# Altium schematic sheet dcdc5v.SchDoc
size A3; Organization: Yandex; Address2: 11 Timura Frunze st., building 2; Release_Date: yyyy-mm-dd; Language: en; Organization2: Self Driving Group LLC
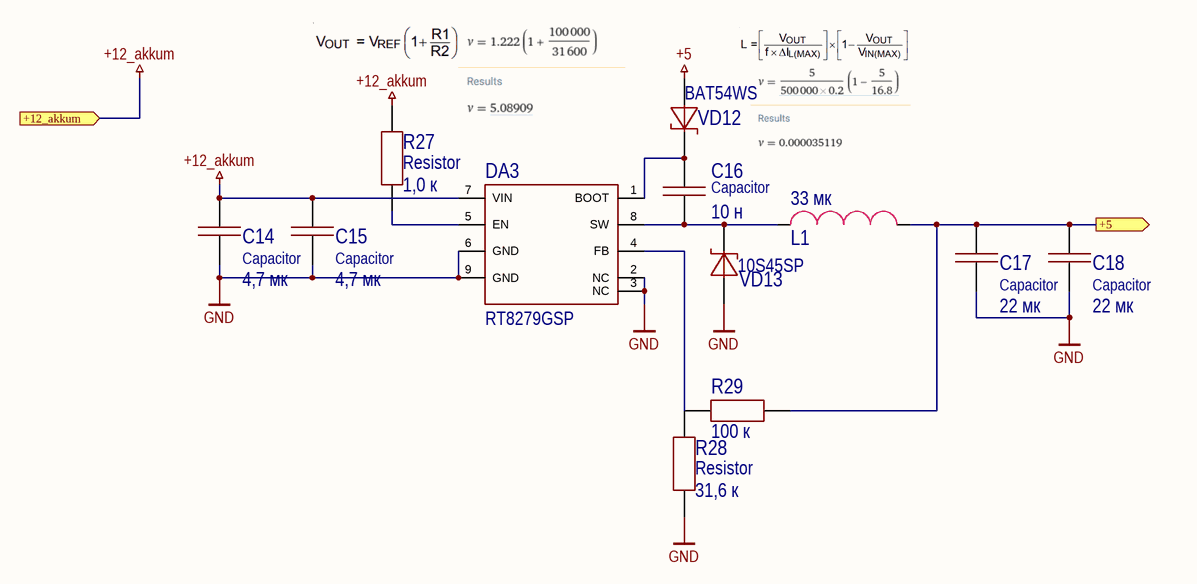
[diagram p0: dcdc5v.SchDoc]

## Parts
C14  Capacitor  value 4,7 мк  [1206C]
C15  Capacitor  value 4,7 мк  [1206C]
C16  Capacitor  value 10 н  [0603C]
C17  Capacitor  value 22 мк  [1210C]
C18  Capacitor  value 22 мк  [1210C]
DA3  RT8279GSP  [8SOP(Exposed_Pad)]
L1  value 33 мк  [IHLP-4040]  (hidden comment: IHLP4040DZER330M11)
R27  Resistor  value 1,0 к  [0603R]
R28  Resistor  value 31,6 к  [0603R]
R29  value 100 к  [0603R]  (hidden comment: Resistor)
VD12  BAT54WS  [SOD-323]
VD13  10S45SP  [TO-277]

## Ports
+5 (out), +12_akkum (in)

## Nets
+5: VD12.1
+12_akkum: C14.2 C15.2 DA3.7(VIN) R27.2 ; port +12_akkum
GND: C14.1 C15.1 C17.1 C18.1 DA3.2(NC) DA3.3(NC) DA3.6(GND) DA3.9(GND) R28.1 VD13.1
+5: C17.2 C18.2 L1.2 R29.2 ; port +5  [a separate net that carries the same name]
NetC16_1: C16.1 DA3.8(SW) L1.1 VD13.2
NetC16_2: C16.2 DA3.1(BOOT) VD12.2
NetDA3_4: DA3.4(FB) R28.2 R29.1
NetDA3_5: DA3.5(EN) R27.1

## Notes on the sheet
- 1
- 2
- 3
- 4
- 5
- 6
- 7
- 8
- A
- B
- C
- D
- E
- Responsible department
- Technical reference
- Document type
- Document status
- F
- Legal owner
- Created by
- Schematic drawing
- Title, Supplementary title
- CONFIDENTIAL
- Yandex
- Commercial secret
- Self Driving Group LLC
- Approved by
- Doc Rev.
- Date of Issue
- Lang.
- Sheet
- A3

## Library data of the parts
C14 C15 = Capacitor_4,7u_10_50V_X7R_1206C: Конденсатор; Tolerance: 0,1; Voltage (V): 50; Dielectric: X7R; Capacity (nF): 4700; Part Number: Capacitor_4,7u_10_50V_X7R_1206C
C16 = Capacitor_10n_10_50V_X7R_0603C: Конденсатор; Tolerance: 0,1; Voltage (V): 50; Dielectric: X7R; Capacity (nF): 10; Part Number: Capacitor_10n_10_50V_X7R_0603C
C17 C18 = Capacitor_22u_10_25V_X7R_1210C: Конденсатор; Tolerance: 0,1; Voltage (V): 25; Dielectric: X7R; Capacity (nF): 22000; Part Number: Capacitor_22u_10_25V_X7R_1210C
DA3 = RT8279GSP: Преобразователь постоянного тока понижающий подстраиваемый выход 5А; Part Number: RT8279GSP
L1 = IHLP4040DZER330M11: ЧИП-индуктивность экранированная 33мкГн ±20% 4,4A 94,5мОм 4040; Inductance (μH): 33; Current (A): 4,4; Part Number: IHLP4040DZER330M11
R27 = Resistor_1.0k_1_0603: Резистор номиналом 1,0 кОм и точностью 1%; Power: *; Part Number: Resistor_1.0k_1_0603; Tolerance: 1%
R28 = Resistor_31.6k_1_0603: Резистор номиналом 31,6 кОм и точностью 1%; Power: *; Part Number: Resistor_31.6k_1_0603; Tolerance: 1%
R29 = Resistor_100k_1_0603: Резистор номиналом 100 кОм и точностью 1%; Power: *; Part Number: Resistor_100k_1_0603; Tolerance: 1%
VD12 = BAT54WS: Диод шоттки на 30 В, ном. ток 0.2 А; Voltage nominal (V): 30; Current (A): 0.2; Part Number: BAT54WS
VD13 = 10S45SP: Диод шоттки на 45 В, ном. ток 10 А; Voltage nominal (V): 45; Current (A): 10; Part Number: 10S45SP